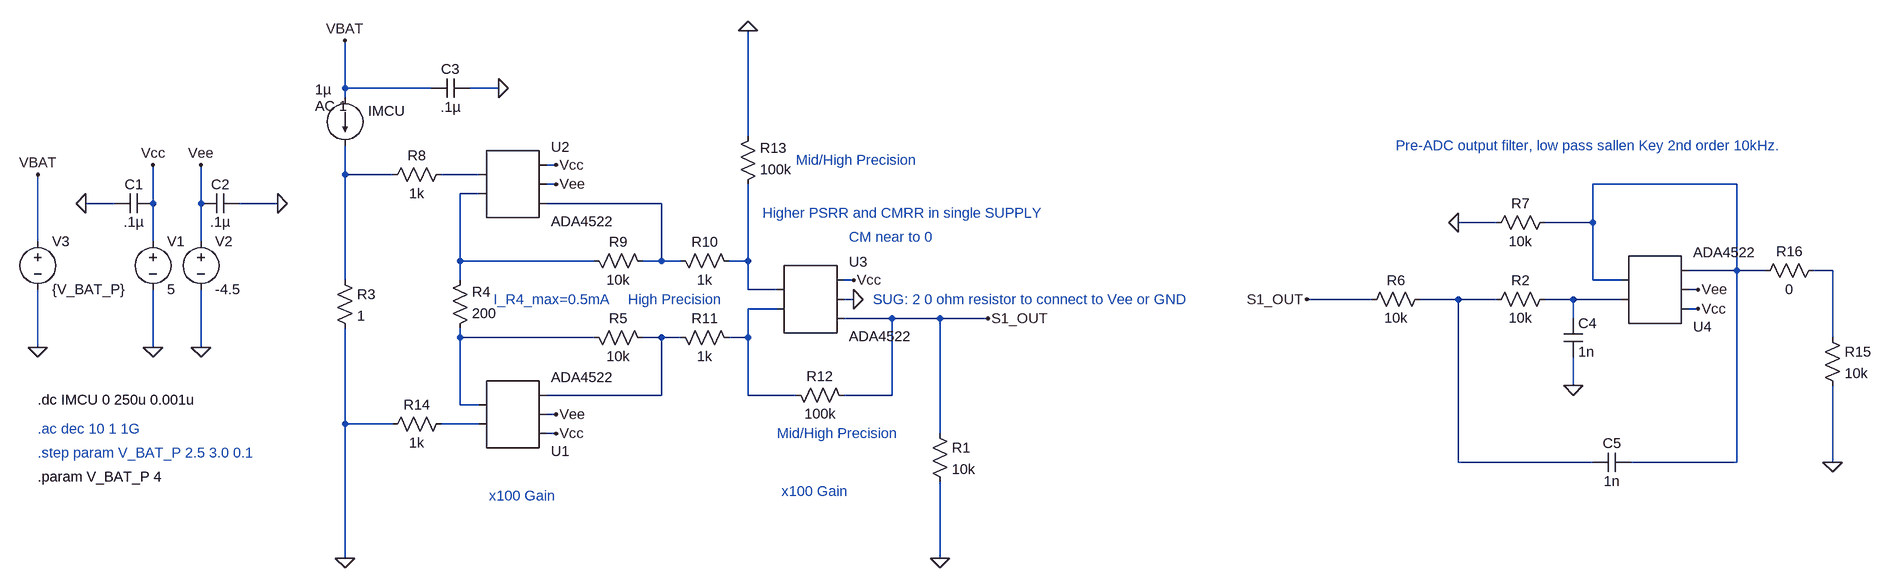
[diagram p0: schematic cm_ad4522_A.asc]
cm_ad4522_A.asc, the LTspice schematic file:
Version 4
SHEET 1 2776 980
WIRE -96 -912 -96 -992
WIRE 48 -912 -96 -912
WIRE 160 -912 112 -912
WIRE -96 -896 -96 -912
WIRE 576 -832 576 -1008
WIRE 256 -784 240 -784
WIRE -96 -768 -96 -816
WIRE -16 -768 -96 -768
WIRE 128 -768 64 -768
WIRE 256 -752 240 -752
WIRE 2544 -752 2304 -752
WIRE 128 -736 96 -736
WIRE -480 -720 -528 -720
WIRE -416 -720 -416 -784
WIRE -336 -720 -336 -784
WIRE -208 -720 -272 -720
WIRE 432 -720 240 -720
WIRE 2144 -688 2080 -688
WIRE 2304 -688 2304 -752
WIRE 2304 -688 2224 -688
WIRE -608 -656 -608 -768
WIRE -416 -656 -416 -720
WIRE -336 -656 -336 -720
WIRE 96 -624 96 -736
WIRE 320 -624 96 -624
WIRE 432 -624 432 -720
WIRE 432 -624 400 -624
WIRE 464 -624 432 -624
WIRE 576 -624 576 -752
WIRE 576 -624 544 -624
WIRE 2544 -608 2544 -752
WIRE 2544 -608 2464 -608
WIRE 2592 -608 2544 -608
WIRE 2704 -608 2672 -608
WIRE -96 -592 -96 -768
WIRE 96 -592 96 -624
WIRE 752 -592 736 -592
WIRE 2304 -592 2304 -688
WIRE 2352 -592 2304 -592
WIRE 576 -576 576 -624
WIRE 624 -576 576 -576
WIRE 2480 -576 2464 -576
WIRE 752 -560 736 -560
WIRE 1936 -560 1776 -560
WIRE 2080 -560 2016 -560
WIRE 2144 -560 2080 -560
WIRE 2272 -560 2224 -560
WIRE 2352 -560 2272 -560
WIRE 624 -544 576 -544
WIRE 2480 -544 2464 -544
WIRE 816 -528 736 -528
WIRE 896 -528 816 -528
WIRE 976 -528 896 -528
WIRE 2272 -528 2272 -560
WIRE 96 -496 96 -512
WIRE 320 -496 96 -496
WIRE 432 -496 400 -496
WIRE 464 -496 432 -496
WIRE 576 -496 576 -544
WIRE 576 -496 544 -496
WIRE 2704 -496 2704 -608
WIRE -608 -480 -608 -576
WIRE -416 -480 -416 -576
WIRE -336 -480 -336 -576
WIRE 2272 -416 2272 -464
WIRE 432 -400 432 -496
WIRE 432 -400 240 -400
WIRE 576 -400 576 -496
WIRE 656 -400 576 -400
WIRE 816 -400 816 -528
WIRE 816 -400 736 -400
WIRE 96 -384 96 -496
WIRE 128 -384 96 -384
WIRE 256 -368 240 -368
WIRE -96 -352 -96 -512
WIRE -16 -352 -96 -352
WIRE 128 -352 64 -352
WIRE 256 -336 240 -336
WIRE 896 -336 896 -528
WIRE 2080 -288 2080 -560
WIRE 2304 -288 2080 -288
WIRE 2544 -288 2544 -608
WIRE 2544 -288 2368 -288
WIRE 2704 -288 2704 -416
WIRE -96 -128 -96 -352
WIRE 896 -128 896 -256
FLAG -416 -480 0
FLAG -416 -784 Vcc
FLAG 160 -912 0
FLAG -608 -480 0
FLAG -608 -768 VBAT
FLAG -96 -992 VBAT
FLAG -96 -128 0
FLAG -336 -480 0
FLAG -336 -784 Vee
FLAG -528 -720 0
FLAG -208 -720 0
FLAG 256 -336 Vcc
FLAG 256 -784 Vcc
FLAG 752 -592 Vcc
FLAG 2480 -544 Vcc
FLAG 2272 -416 0
FLAG 2080 -688 0
FLAG 976 -528 S1_OUT
FLAG 2480 -576 Vee
FLAG 2704 -288 0
FLAG 1776 -560 S1_OUT
FLAG 256 -752 Vee
FLAG 256 -368 Vee
FLAG 576 -1008 0
FLAG 752 -560 0
FLAG 896 -128 0
SYMBOL voltage -416 -672 R0
WINDOW 123 0 0 Left 2
WINDOW 39 0 0 Left 2
SYMATTR InstName V1
SYMATTR Value 5
SYMBOL cap 48 -896 R270
WINDOW 0 32 32 VTop 2
WINDOW 3 0 32 VBottom 2
SYMATTR InstName C3
SYMATTR Value .1µ
SYMBOL voltage -608 -672 R0
WINDOW 123 0 0 Left 2
WINDOW 39 0 0 Left 2
SYMATTR InstName V3
SYMATTR Value {V_BAT_P}
SYMBOL res -112 -608 R0
SYMATTR InstName R3
SYMATTR Value 1
SYMATTR SpiceLine tol=0.01 pwr=100m
SYMBOL voltage -336 -672 R0
WINDOW 123 0 0 Left 2
WINDOW 39 0 0 Left 2
SYMATTR InstName V2
SYMATTR Value -4.5
SYMBOL cap -416 -736 R90
WINDOW 0 0 32 VBottom 2
WINDOW 3 32 32 VTop 2
SYMATTR InstName C1
SYMATTR Value .1µ
SYMBOL cap -272 -736 R90
WINDOW 0 0 32 VBottom 2
WINDOW 3 32 32 VTop 2
SYMATTR InstName C2
SYMATTR Value .1µ
SYMBOL AutoGenerated\\ADA4522 192 -368 M180
SYMATTR InstName U1
SYMBOL res 80 -496 M180
WINDOW 0 36 76 Left 2
WINDOW 3 36 40 Left 2
SYMATTR InstName R4
SYMATTR Value 200
SYMBOL res 416 -480 M270
WINDOW 0 32 56 VTop 2
WINDOW 3 0 56 VBottom 2
SYMATTR InstName R5
SYMATTR Value 10k
SYMBOL res 416 -608 M270
WINDOW 0 32 56 VTop 2
WINDOW 3 0 56 VBottom 2
SYMATTR InstName R9
SYMATTR Value 10k
SYMBOL res 560 -608 M270
WINDOW 0 32 56 VTop 2
WINDOW 3 0 56 VBottom 2
SYMATTR InstName R10
SYMATTR Value 1k
SYMBOL res 560 -480 M270
WINDOW 0 32 56 VTop 2
WINDOW 3 0 56 VBottom 2
SYMATTR InstName R11
SYMATTR Value 1k
SYMBOL AutoGenerated\\ADA4522 688 -560 R0
SYMATTR InstName U3
SYMBOL AutoGenerated\\ADA4522 192 -752 R0
SYMATTR InstName U2
SYMBOL res 752 -384 M270
WINDOW 0 32 56 VTop 2
WINDOW 3 0 56 VBottom 2
SYMATTR InstName R12
SYMATTR Value 100k
SYMBOL res 560 -736 M180
WINDOW 0 36 76 Left 2
WINDOW 3 36 40 Left 2
SYMATTR InstName R13
SYMATTR Value 100k
SYMBOL current -96 -896 R0
WINDOW 123 -50 14 Left 2
WINDOW 39 0 0 Left 2
WINDOW 3 -50 -14 Left 2
WINDOW 0 39 22 Left 2
SYMATTR Value2 AC 1
SYMATTR Value 1µ
SYMATTR InstName IMCU
SYMBOL res 2240 -576 R90
WINDOW 0 0 56 VBottom 2
WINDOW 3 32 56 VTop 2
SYMATTR InstName R2
SYMATTR Value 10k
SYMBOL res 2032 -576 R90
WINDOW 0 0 56 VBottom 2
WINDOW 3 32 56 VTop 2
SYMATTR InstName R6
SYMATTR Value 10k
SYMBOL cap 2256 -528 R0
SYMATTR InstName C4
SYMATTR Value 1n
SYMBOL cap 2368 -304 R90
WINDOW 0 0 32 VBottom 2
WINDOW 3 32 32 VTop 2
SYMATTR InstName C5
SYMATTR Value 1n
SYMBOL res 2240 -704 R90
WINDOW 0 0 56 VBottom 2
WINDOW 3 32 56 VTop 2
SYMATTR InstName R7
SYMATTR Value 10k
SYMBOL AutoGenerated\\ADA4522 2416 -576 M180
SYMATTR InstName U4
SYMBOL res 80 -784 R90
WINDOW 0 0 56 VBottom 2
WINDOW 3 32 56 VTop 2
SYMATTR InstName R8
SYMATTR Value 1k
SYMATTR SpiceLine tol=0.01 pwr=100m
SYMBOL res 80 -368 R90
WINDOW 0 0 56 VBottom 2
WINDOW 3 32 56 VTop 2
SYMATTR InstName R14
SYMATTR Value 1k
SYMATTR SpiceLine tol=0.01 pwr=100m
SYMBOL res 2688 -512 R0
SYMATTR InstName R15
SYMATTR Value 10k
SYMBOL res 2688 -624 R90
WINDOW 0 0 56 VBottom 2
WINDOW 3 32 56 VTop 2
SYMATTR InstName R16
SYMATTR Value 0
SYMBOL res 880 -352 R0
SYMATTR InstName R1
SYMATTR Value 10k
TEXT -608 -304 Left 2 ;.step param V_BAT_P 2.5 3.0 0.1
TEXT -608 -264 Left 2 !.param V_BAT_P 4
TEXT -608 -392 Left 2 !.dc IMCU 0 250u 0.001u
TEXT 376 -560 Left 2 ;High Precision
TEXT 656 -792 Left 2 ;Mid/High Precision
TEXT -608 -344 Left 2 ;.ac dec 10 1 1G
TEXT 744 -664 Left 2 ;CM near to 0
TEXT 624 -336 Left 2 ;Mid/High Precision
TEXT 784 -560 Left 2 ;SUG: 2 0 ohm resistor to connect to Vee or GND
TEXT 600 -704 Left 2 ;Higher PSRR and CMRR in single SUPPLY
TEXT 1976 -816 Left 2 ;Pre-ADC output filter, low pass sallen Key 2nd order 10kHz.
TEXT 152 -560 Left 2 ;I_R4_max=0.5mA
TEXT 144 -232 Left 2 ;x100 Gain
TEXT 632 -240 Left 2 ;x100 Gain

The netlist it stands for:
* cm_ad4522_A.asc
V1 Vcc 0 5
C3 VBAT 0 .1µ
V3 VBAT 0 {V_BAT_P}
R3 N001 0 1 tol=0.01 pwr=100m
V2 Vee 0 -4.5
C1 Vcc 0 .1µ
C2 0 Vee .1µ
* U1: ADA4522 (symbol AutoGenerated\ADA4522 not available, pins judged from their places): pin1=N013 pin2=N011 pin3=Vcc pin4=Vee pin5=N012
R4 N011 N004 200
R5 N012 N011 10k
R9 N005 N004 10k
R10 N006 N005 1k
R11 N010 N012 1k
* U3: ADA4522 (symbol AutoGenerated\ADA4522 not available, pins judged from their places): pin1=N006 pin2=N010 pin3=Vcc pin4=0 pin5=S1_OUT
* U2: ADA4522 (symbol AutoGenerated\ADA4522 not available, pins judged from their places): pin1=N002 pin2=N004 pin3=Vcc pin4=Vee pin5=N005
R12 S1_OUT N010 100k
R13 N006 0 100k
IMCU VBAT N001 1µ AC 1
R2 N009 N008 10k
R6 N008 S1_OUT 10k
C4 N009 0 1n
C5 N003 N008 1n
R7 N003 0 10k
* U4: ADA4522 (symbol AutoGenerated\ADA4522 not available, pins judged from their places): pin1=N009 pin2=N003 pin3=Vcc pin4=Vee pin5=N003
R8 N002 N001 1k tol=0.01 pwr=100m
R14 N013 0 1k tol=0.01 pwr=100m
R15 N007 0 10k
R16 N007 N003 0
R1 S1_OUT 0 10k
* .step param V_BAT_P 2.5 3.0 0.1
.param V_BAT_P 4
.dc IMCU 0 250u 0.001u
* High Precision
* Mid/High Precision
* .ac dec 10 1 1G
* CM near to 0
* Mid/High Precision
* SUG: 2 0 ohm resistor to connect to Vee or GND
* Higher PSRR and CMRR in single SUPPLY
* Pre-ADC output filter, low pass sallen Key 2nd order 10kHz.
* I_R4_max=0.5mA
* x100 Gain
* x100 Gain
.backanno
.end